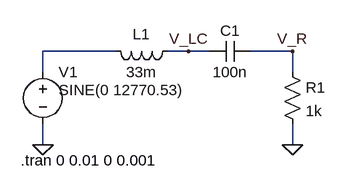
[diagram p0: schematic Figure25_1.asc]
Figure25_1.asc, the LTspice schematic file:
Version 4
SHEET 1 880 680
WIRE 112 96 0 96
WIRE 224 96 192 96
WIRE 256 96 224 96
WIRE 384 96 320 96
WIRE 0 128 0 96
WIRE 384 128 384 96
WIRE 0 240 0 208
WIRE 384 240 384 208
FLAG 0 240 0
FLAG 384 240 0
FLAG 224 96 V_LC
FLAG 384 96 V_R
SYMBOL voltage 0 112 R0
WINDOW 123 24 124 Left 2
WINDOW 39 0 0 Left 0
WINDOW 3 24 44 Left 2
SYMATTR InstName V1
SYMATTR Value SINE(0 12770.53)
SYMBOL res 368 112 R0
SYMATTR InstName R1
SYMATTR Value 1k
SYMBOL cap 320 80 R90
WINDOW 0 0 32 VBottom 2
WINDOW 3 32 32 VTop 2
SYMATTR InstName C1
SYMATTR Value 100n
SYMBOL ind 208 80 R90
WINDOW 0 5 56 VBottom 2
WINDOW 3 32 56 VTop 2
SYMATTR InstName L1
SYMATTR Value 33m
TEXT -34 264 Left 2 !.tran 0 0.01 0 0.001

The netlist it stands for:
* Figure25_1.asc
V1 N001 0 SINE(0 12770.53)
R1 V_R 0 1k
C1 V_R V_LC 100n
L1 V_LC N001 33m
.tran 0 0.01 0 0.001
.backanno
.end